# EasyEDA Pro project 【JHP硬件工作室】导出参考工程.epro

# Schematic Schematic1
Create Date: 2024-01-20; Page Name: P1; Project Name: New Project_2024-01-20_14-11-34; Schematic Name: Schematic1; Update Date: 2024-01-20; Company: 嘉立创EDA; Page Size: A4; Version: V1.0
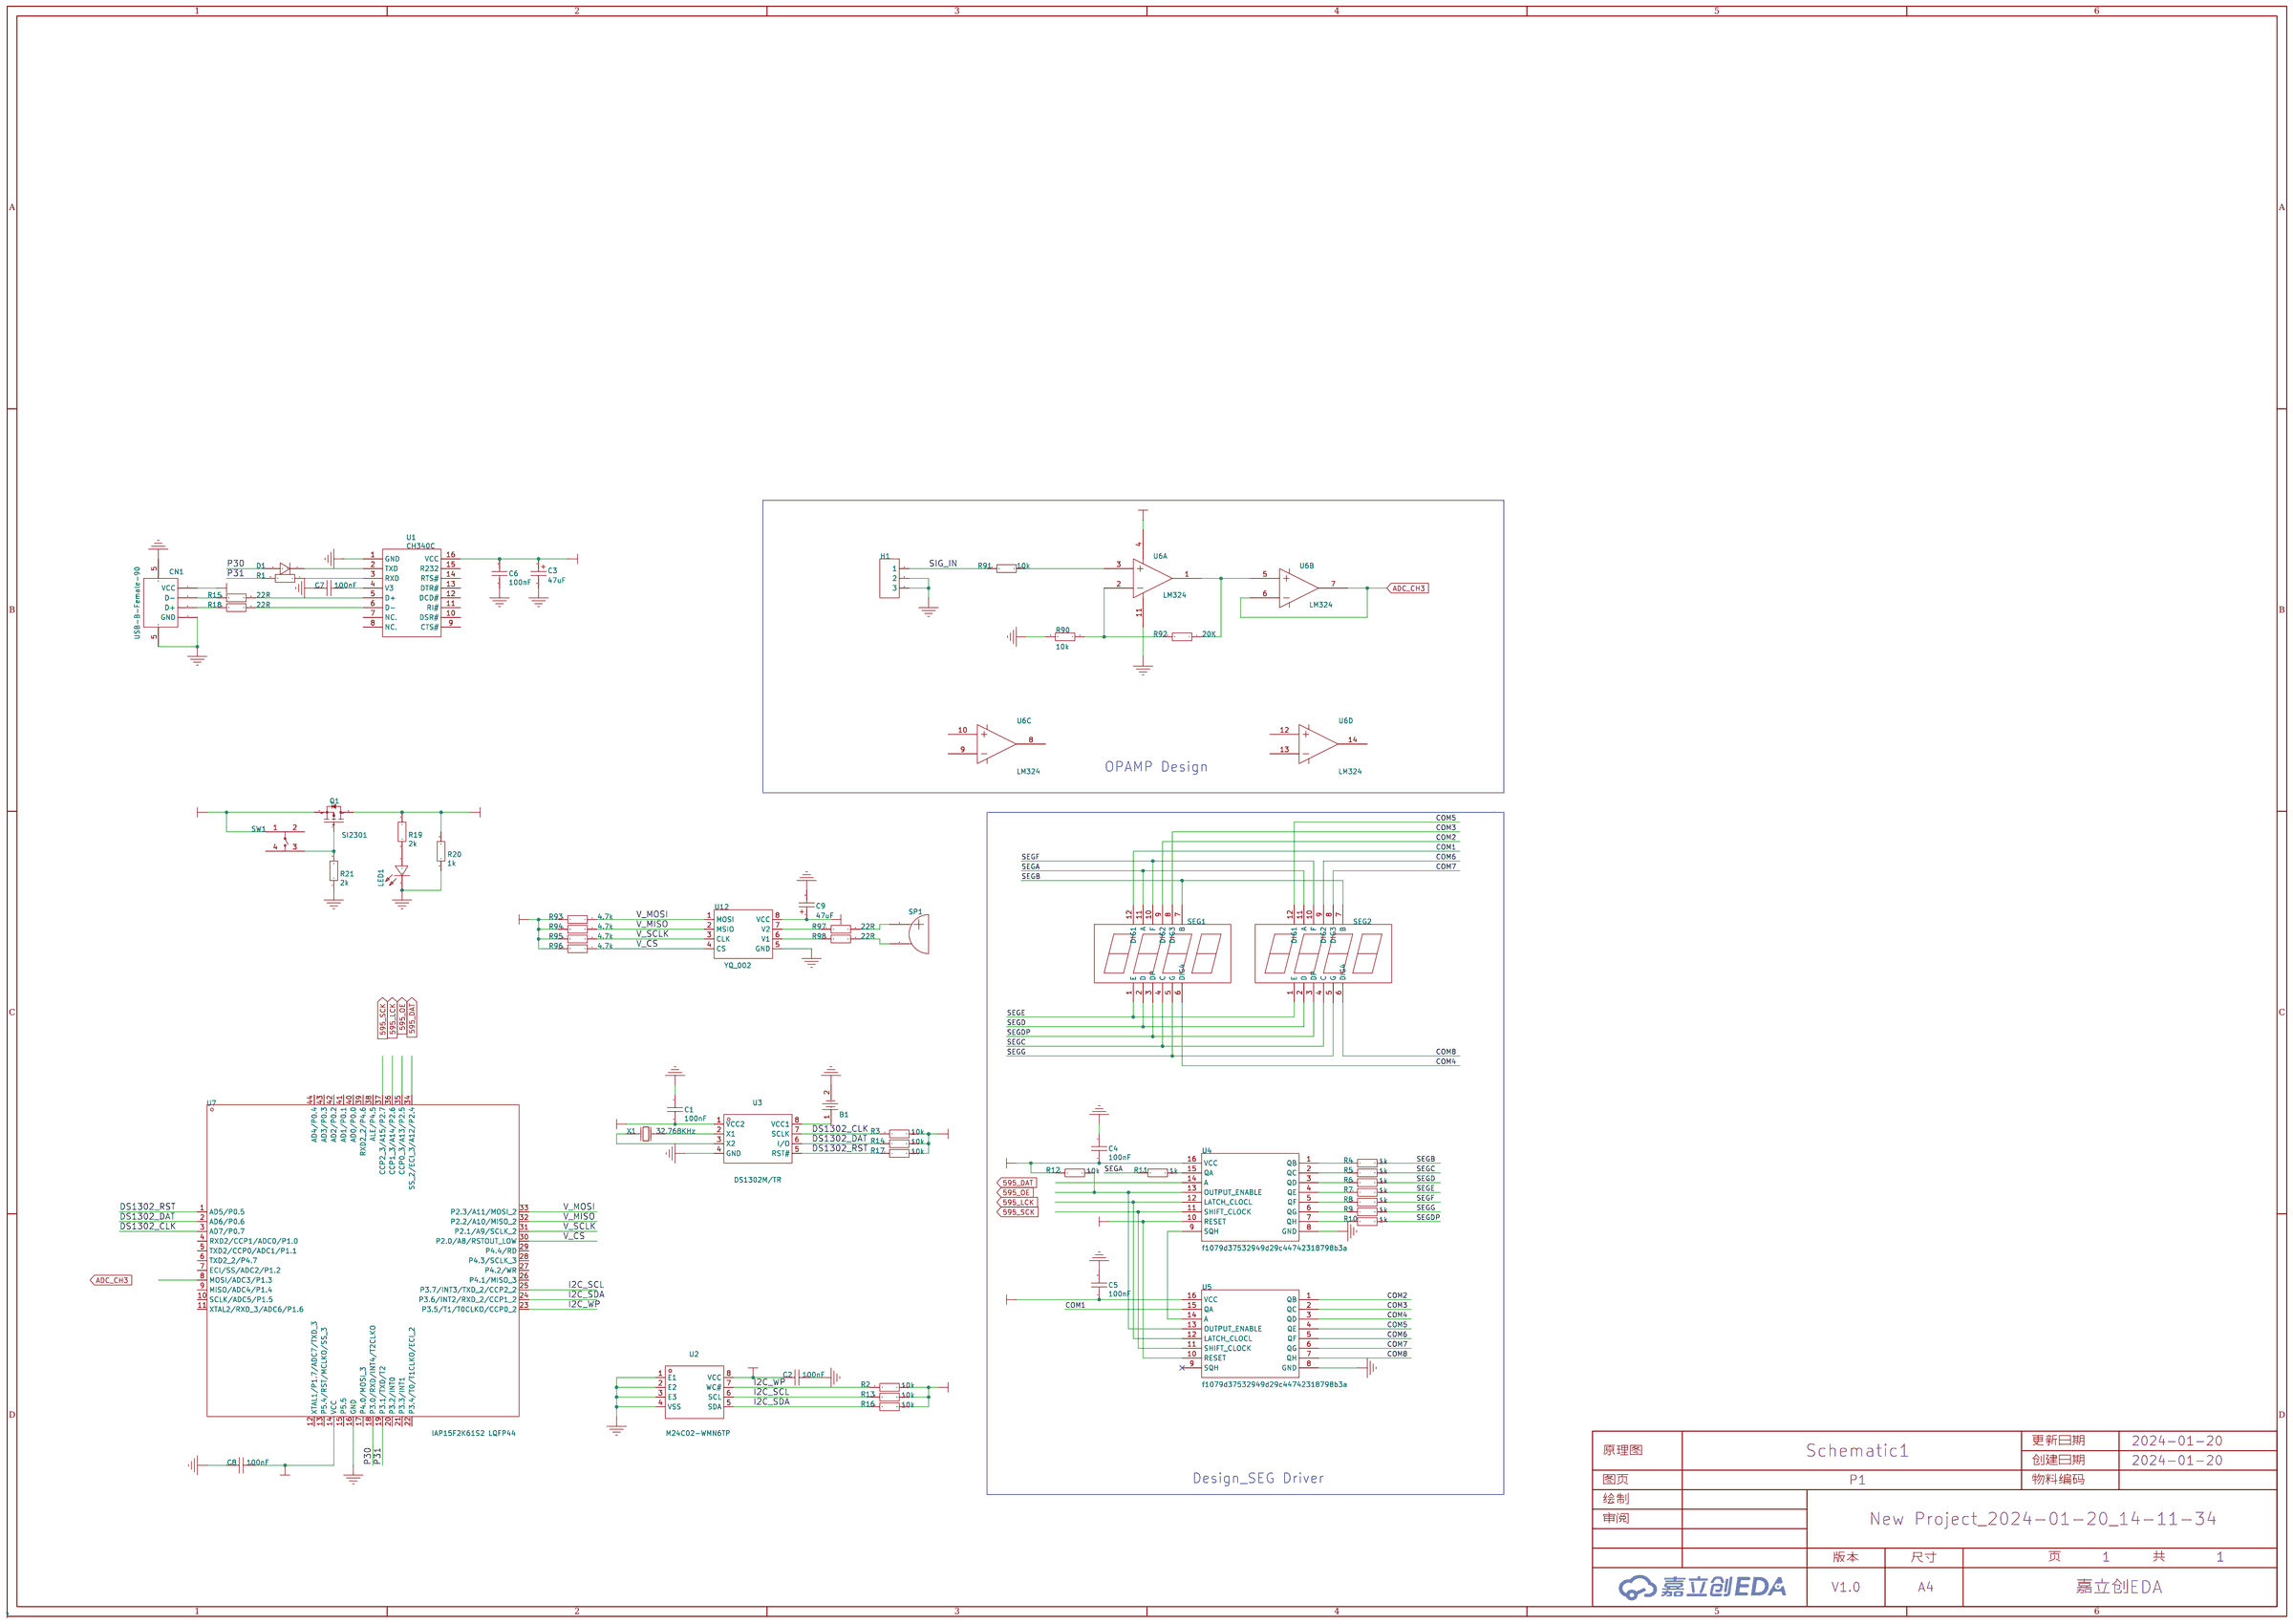
[diagram p0: schematic sheet]

## Parts
B1  CR1220-2  [BAT-CR1220]
C1  100nF  [C0805]
C2  100nF  [C0805]
C3  47uF  [CAP]
C4  100nF  [C0805]
C5  100nF  [C0805]
C6  100nF  [C0805]
C7  100nF  [C0805]
C8  100nF  [C0805]
C9  47uF  [CAP]
CN1  USB-B-Female-90  [USB-B]
D1  KLL4148  [DIODE]
H1  HDR-F-2.54_1x3  [HDR-F-2.54_1X3]
LED1  17-21URC/TR8  [LED0805]
Q1  SI2301  [SOT-23-3]
R1  1k  [R0805]
R2  10k  [R0805]
R3  10k  [R0805]
R4  1k  [R0805]
R5  1k  [R0805]
R6  1k  [R0805]
R7  1k  [R0805]
R8  1k  [R0805]
R9  1k  [R0805]
R10  1k  [R0805]
R11  1k  [R0805]
R12  10k  [R0805]
R13  10k  [R0805]
R14  10k  [R0805]
R15  22R  [R0805]
R16  10k  [R0805]
R17  10k  [R0805]
R18  22R  [R0805]
R19  2k  [R0805]
R20  1k  [R0805]
R21  2k  [R0805]
R90  10k  [R0805]
R91  10k  [R0805]
R92  20K  [R0805]
R93  4.7k  [R0805]
R94  4.7k  [R0805]
R95  4.7k  [R0805]
R96  4.7k  [R0805]
R97  22R  [R0805]
R98  22R  [R0805]
SEG1  5f80ded45edf411e9465a986f6a50c26  [LED-SEG]
SEG2  5f80ded45edf411e9465a986f6a50c26  [LED-SEG]
SP1  BUZZER  [BUZZ]
SW1  TS-1159UB-B-D-BL  [SW-SMD_4P]
U1  CH340C  [SOP-16]
U2  M24C02-WMN6TP  [SOP-8]
U3  DS1302M/TR  [SOP-8]
U4  f1079d37532949d29c44742318798b3a  [SOP-16]
U5  f1079d37532949d29c44742318798b3a  [SOP-16]
U6  LM324  [SO-14]  (sections 1,2,3,4)
U7  IAP15F2K61S2 LQFP44  [LQFP-44]
U12  YQ_002  [BW-SOP-8]
X1  32.768KHz  [XTAL-DT38]

## Library data of the parts
B1 = CR1220-2: Supplier: LCSC; Manufacturer: Q&J; image: //image.lceda.cn/szlcsc/C70381.jpg; Supplier Part: C70381
C1 C2 C4-C8 = 100nF: Supplier: LCSC; Manufacturer: FH; Manufacturer Part: 0805F104M500NT; Supplier Part: C28378
C3 C9 = 47uF: Polarized Capacitor (Axial); Design Item ID: Cap Pol2; Library Name: Miscellaneous Devices
CN1 = USB-B-Female-90: Supplier: LCSC; Manufacturer: ValuePro; Manufacturer Part: USB-BF90; image: //image.lceda.cn/szlcsc/C46392.jpg; Supplier Part: C46392
D1 = KLL4148: Supplier: LCSC; Supplier Part: C369941; Manufacturer: KEXIN
H1 = HDR-F-2.54_1x3: Supplier Part: C146690; Supplier: LCSC; Library Name: CT105
LED1 = 17-21URC/TR8: Supplier: LCSC; Supplier Part: C264414; Manufacturer: Everlight Elec
Q1 = SI2301: Supplier: LCSC; Manufacturer: Hottech; Supplier Part: C181086; JLCPCB Part Class: Extend
R1 R20 = 1k: Supplier: LCSC; Manufacturer: UniOhm; Manufacturer Part: 080500J0104T5E; Supplier Part: C149503
R2-R14 R16 R17 = 10k: Supplier: LCSC; Manufacturer: UniOhm; Manufacturer Part: 080500J0104T5E; Supplier Part: C149503
R15 R18 R97 R98 = 22R: Supplier: LCSC; Manufacturer: UniOhm; Manufacturer Part: 080500J0104T5E; Supplier Part: C149503; Design Item ID: 1k
R19 R21 = 2k: Supplier: LCSC; Manufacturer: UniOhm; Manufacturer Part: 080500J0104T5E; Supplier Part: C149503
R90 R91 = 10k: Supplier: LCSC; Manufacturer: UniOhm; Manufacturer Part: 080500J0104T5E; Supplier Part: C149503; Design Item ID: 1k
R92 = ?: Supplier: LCSC; Manufacturer: UniOhm; Manufacturer Part: 080500J0104T5E; Supplier Part: C149503; Design Item ID: 1k
R93-R96 = 4.7k: Supplier: LCSC; Manufacturer: UniOhm; Manufacturer Part: 080500J0104T5E; Supplier Part: C149503; Design Item ID: 1k
SEG1 SEG2 = SEG
SP1 = BUZZER: Buzzer; Library Name: *
SW1 = TS-1159UB-B-D-BL: Supplier: LCSC; Supplier Part: C692480; Manufacturer: XKB Connectivity
U1 = CH340C: Supplier: LCSC; Manufacturer: WCH; Supplier Part: C84681; JLCPCB Part Class: Extend
U2 = M24C02-WMN6TP: Supplier: LCSC; Manufacturer: STMicroelectronics; image: //image.lceda.cn/szlcsc/C7562.jpg; Supplier Part: C7562; JLCPCB Part Class: Basic
U3 = DS1302M/TR: Supplier: LCSC; Supplier Part: C434511; Manufacturer: HGSEMI
U4 U5 = 74HC595M/TR
U6 = LM324: Design Item ID: LM124; Library Name: *
U7 = IAP15F2K61S2 LQFP44: Supplier: LCSC; Manufacturer: STC; Supplier Part: C47451; JLCPCB Part Class: Extend
U12 = YQ_002: Design Item ID: LQ2021; Library Name: CT105
X1 = 32.768KHz: Supplier: LCSC; Supplier Part: C252404; Manufacturer: SHENZHEN CRYSTAL TECH; Manufacturer Part: 6K832768F12UB

## Nets
+5V: C1.1 C2.1 C4.1 C5.1 C8.2 C9.1 Q1.3(D) R2.2 R3.2 R12.1 R13.2 R14.2 R16.2 R17.2 R19.2 R20.2 R93.2 R94.2 R95.2 R96.2 U2.8(VCC) U3.1(VCC2) U4.10(RESET) U4.16(VCC) U5.10(RESET) U5.16(VCC) U6.4 U7.14(VCC) U12.8(VCC)
GND: B1.2 C1.2 C2.2 C3.2 C4.2 C5.2 C6.1 C7.1 C8.1 C9.2 CN1.4(GND) CN1.5(SH2) H1.2 H1.3 LED1.2(K) R20.1 R21.1 R90.2 U1.1(GND) U2.1(E1) U2.2(E2) U2.3(E3) U2.4(VSS) U3.4(GND) U4.8(GND) U5.8(GND) U6.11 U7.16(GND) U12.5(GND)
595_DAT: U4.14(A) U7.34(SS_2/ECI_3/A12/P2.4)
595_LCK: U4.12(LATCH_CLOCL) U5.12(LATCH_CLOCL) U7.36(CCP1_3/A14/P2.6)
595_OE: R12.2 U4.13(OUTPUT_ENABLE) U5.13(OUTPUT_ENABLE) U7.35(CCP0_3/A13/P2.5)
595_SCK: U4.11(SHIFT_CLOCK) U5.11(SHIFT_CLOCK) U7.37(CCP2_3/A15/P2.7)
ADC_CH3: U7.8(MOSI/ADC3/P1.3)
COM1: SEG1.12(DIG1) U5.15(QA)
COM2: SEG1.9(DIG2) U5.1(QB)
COM3: SEG1.8(DIG3) U5.2(QC)
COM4: SEG1.6(DIG4) U5.3(QD)
COM5: SEG2.12(DIG1) U5.4(QE)
COM6: SEG2.9(DIG2) U5.5(QF)
COM7: SEG2.8(DIG3) U5.6(QG)
COM8: SEG2.6(DIG4) U5.7(QH)
DS1302_CLK: R3.1 U3.7(SCLK) U7.3(AD7/P0.7)
DS1302_DAT: R14.1 U3.6(I/O) U7.2(AD6/P0.6)
DS1302_RST: R17.1 U3.5(RST#) U7.1(AD5/P0.5)
I2C_SCL: R13.1 U2.6(SCL) U7.25(P3.7/INT3/TXD_2/CCP2_2)
I2C_SDA: R16.1 U2.5(SDA) U7.24(P3.6/INT2/RXD_2/CCP1_2)
I2C_WP: R2.1 U2.7(WC#) U7.23(P3.5/T1/T0CLKO/CCP0_2)
P30: D1.2(A) U7.18(P3.0/RXD/INT4/T2CLKO)
P31: R1.2 U7.19(P3.1/TXD/T2)
SEGA: R11.1 SEG1.11(A) SEG2.11(A)
SEGB: R4.2 SEG1.7(B) SEG2.7(B)
SEGC: R5.2 SEG1.4(C) SEG2.4(C)
SEGD: R6.2 SEG1.2(D) SEG2.2(D)
SEGDP: R10.2 SEG1.3(DP) SEG2.3(DP)
SEGE: R7.2 SEG1.1(E) SEG2.1(E)
SEGF: R8.2 SEG1.10(F) SEG2.10(F)
SEGG: R9.2 SEG1.5(G) SEG2.5(G)
SIG_IN: H1.1 R91.2
V_CS: R96.1 U7.30(P2.0/A8/RSTOUT_LOW) U12.4(CS)
V_MISO: R94.1 U7.32(P2.2/A10/MISO_2) U12.2(MSIO)
V_MOSI: R93.1 U7.33(P2.3/A11/MOSI_2) U12.1(MOSI)
V_SCLK: R95.1 U7.31(P2.1/A9/SCLK_2) U12.3(CLK)
VUSB: C3.1 C6.2 CN1.1(VCC) Q1.2(S) SW1.1 U1.16(VCC)
$1N1823: U3.2(X1) X1.2(OSC2)
$1N1825: U3.3(X2) X1.1(OSC1)
$1N1898: B1.1 U3.8(VCC1)
$1N1910: R1.1 U1.3(RXD)
$1N1912: D1.1(C) U1.2(TXD)
$1N1918: C7.2 U1.4(V3)
$1N1920: CN1.2(D-) R15.2
$1N1922: CN1.3(D+) R18.2
$1N1964: Q1.1(G) R21.2 SW1.3
$1N1967: U6.6 U6.7
$1N1974: R91.1 U6.3
$1N1985: R92.1 U6.1 U6.5
$1N1990: R90.1 R92.2 U6.2
$1N1998: R98.1 U12.6(V1)
$1N2000: R97.1 U12.7(V2)
$1N2030: R97.2 SP1.1
$1N2034: R98.2 SP1.2
$1N2066: LED1.1(A) R19.1
$1N4705: R11.2 U4.15(QA)
$1N4961: R4.1 U4.1(QB)
$1N4962: R5.1 U4.2(QC)
$1N4964: R6.1 U4.3(QD)
$1N4966: R7.1 U4.4(QE)
$1N4968: R8.1 U4.5(QF)
$1N4970: R9.1 U4.6(QG)
$1N4972: R10.1 U4.7(QH)
$1N5017: U4.9(SQH) U5.14(A)
$1N6015: R15.1 U1.5(D+)
$1N6017: R18.1 U1.6(D-)

Not connected (* = marked no-connect by the designer): SW1 2 4; U1 7(NC.) 8(NC.) 9(CTS#) 10(DSR#) 11(RI#) 12(DCD#) 13(DTR#) 14(RTS#) 15(R232); U5 9(SQH)*; U6 8 9 10 12 13 14; U7 4(RXD2/CCP1/ADC0/P1.0) 5(TXD2/CCP0/ADC1/P1.1) 6(TXD2_2/P4.7) 7(ECI/SS/ADC2/P1.2) 9(MISO/ADC4/P1.4) 10(SCLK/ADC5/P1.5) 11(XTAL2/RXD_3/ADC6/P1.6) 12(XTAL1/P1.7/ADC7/TXD_3) 13(P5.4/RST/MCLKO/SS_3) 15(P5.5) 17(P4.0/MOSI_3) 20(P3.2/INT0) 21(P3.3/INT1) 22(P3.4/T0/T1CLKO/ECI_2) 26(P4.1/MISO_3) 27(P4.2/WR) 28(P4.3/SCLK_3) 29(P4.4/RD) 38(ALE/P4.5) 39(RXD2_2/P4.6) 40(AD0/P0.0) 41(AD1/P0.1) 42(AD2/P0.2) 43(AD3/P0.3) 44(AD4/P0.4)

## Notes on the sheet
- OPAMP Design
- Design_SEG Driver

# Board PCB1
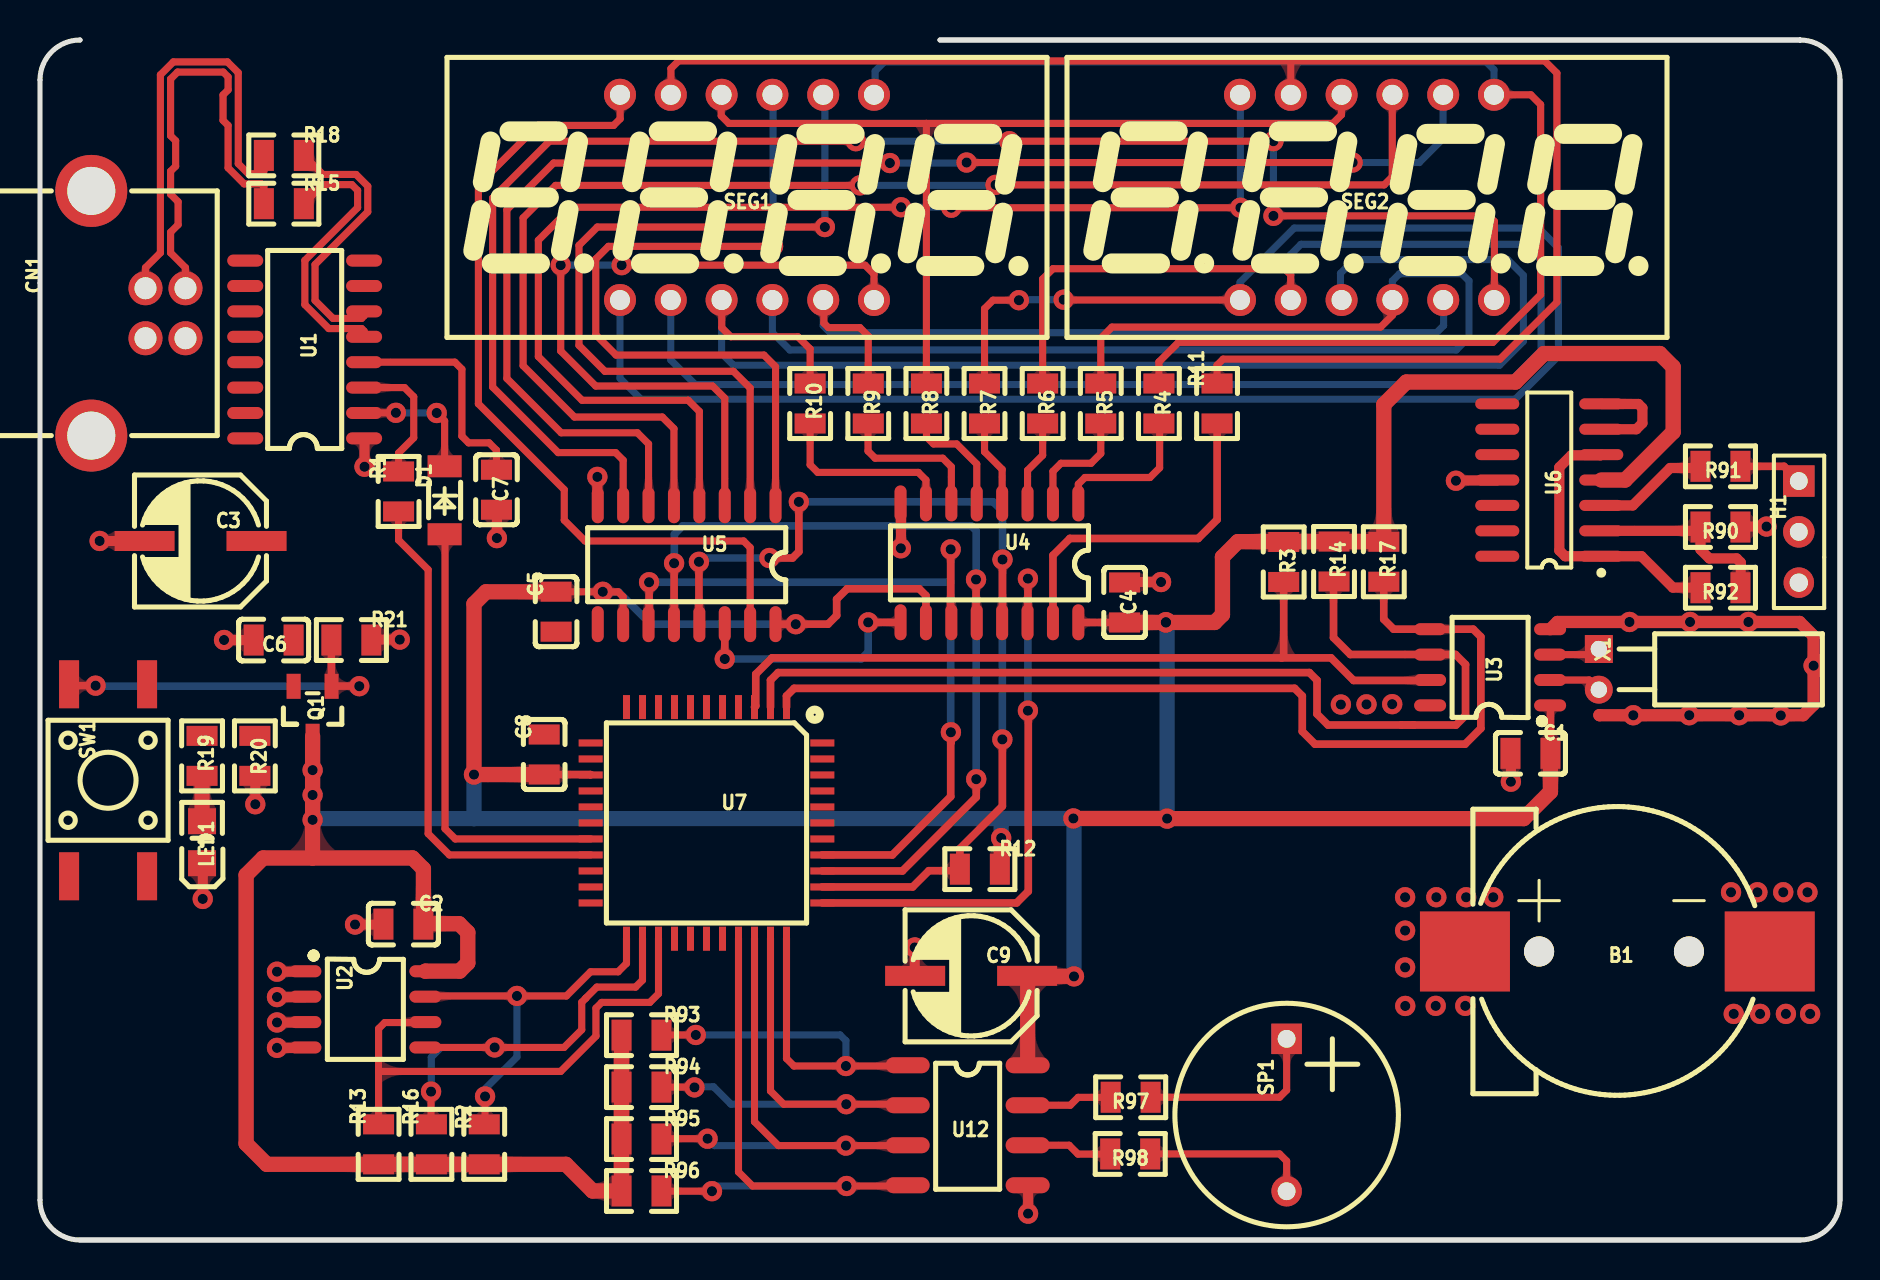
[diagram p1: board, top side]
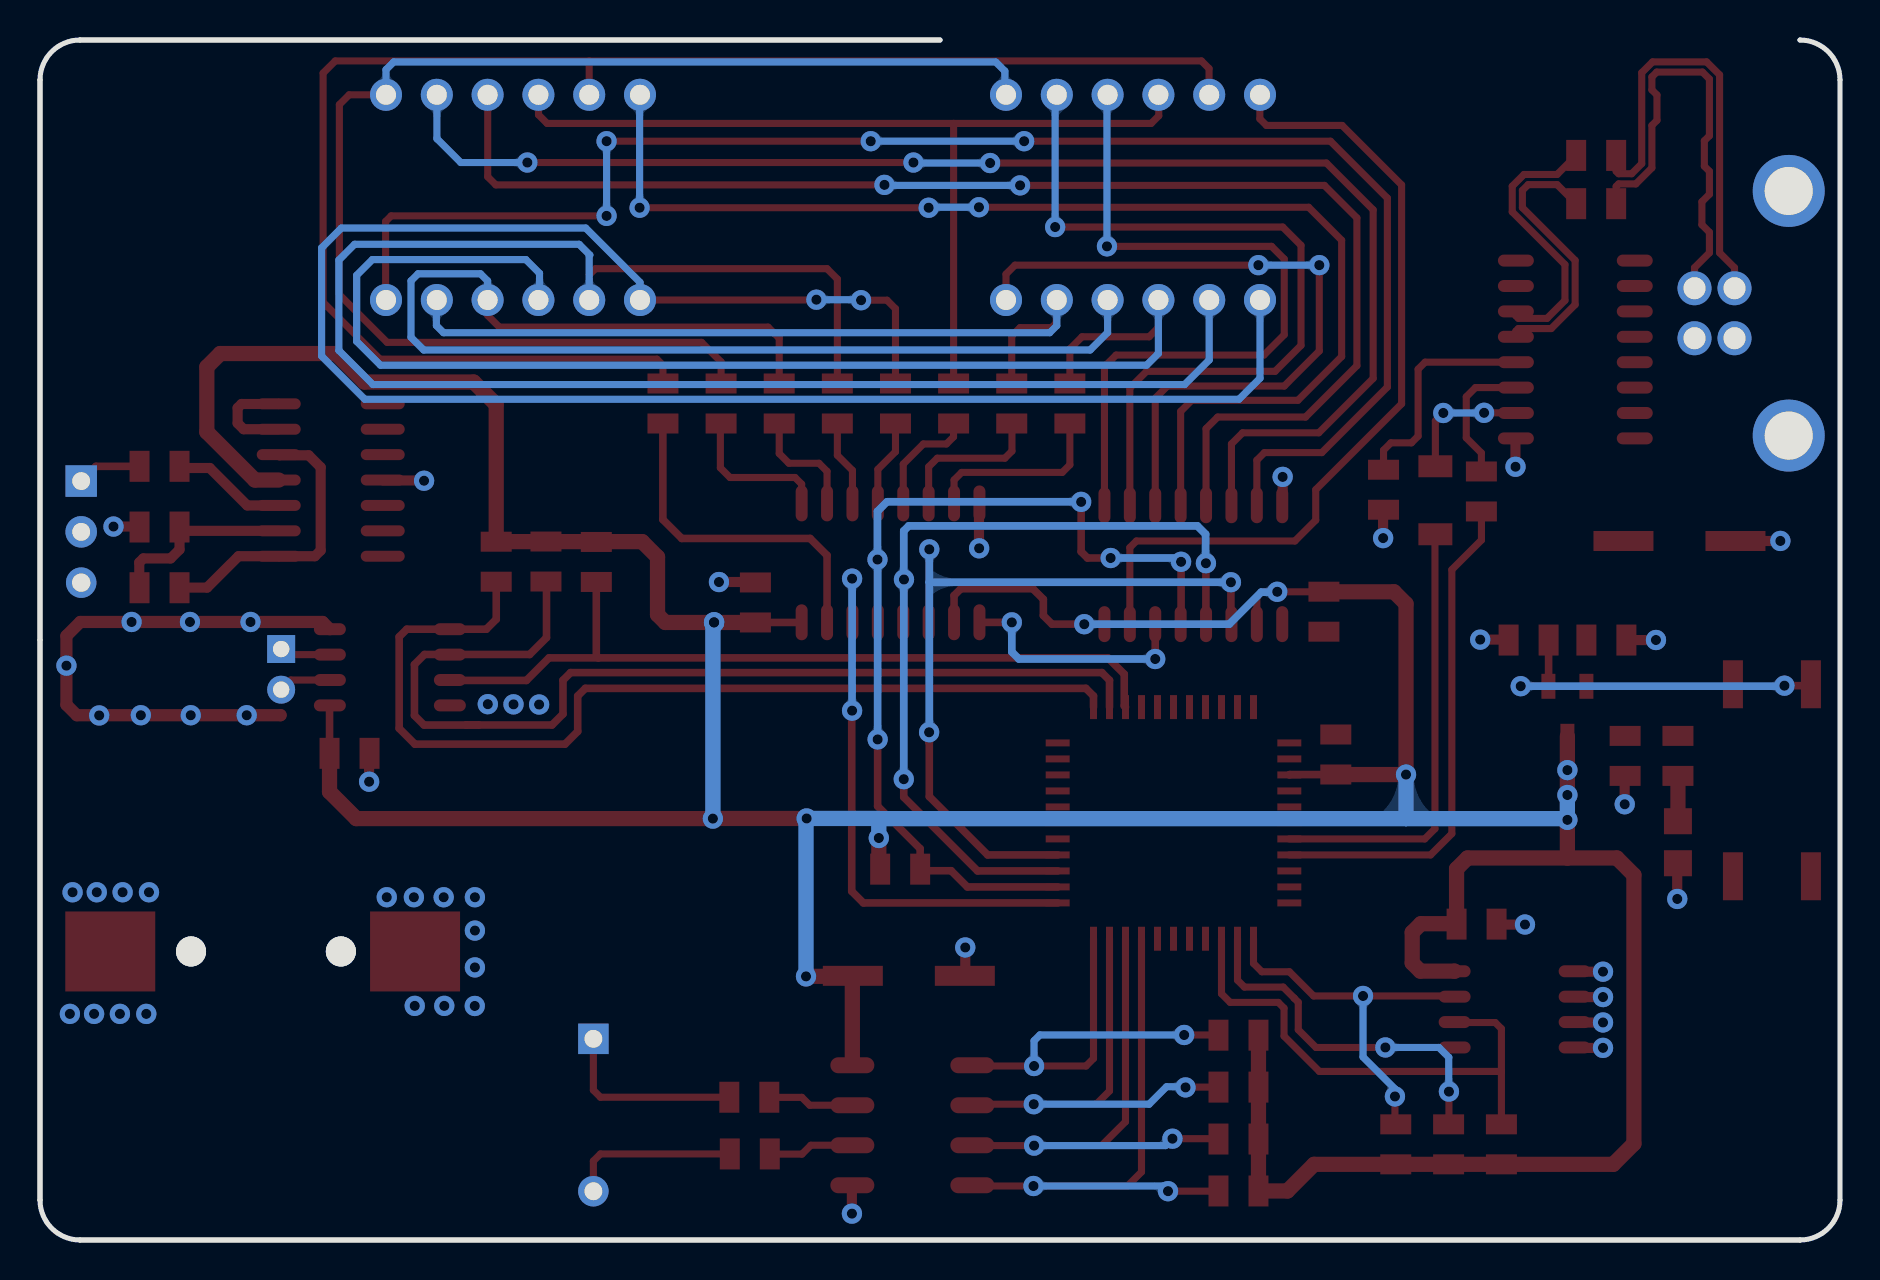
[diagram p2: board, bottom side, seen from below]

Outline 90 x 60 mm; copper layers: Top Layer, Bottom Layer. Coordinates in mm from the lower left corner of the outline.
Outline path: 2,60 arc(0.59,59.41) 0,58 0,2 arc(0.59,0.59) 2,0 ; 2,0 88,0 ; 2,0 88,0 ; 88,0 arc(89.41,0.59) 90,2 ; 88,60 45,60 88,60 ; 88,60 arc(89.41,59.41) 90,58 ; 90,58 90,2 ; 90,58 90,2
Stack: Top Layer 0.035mm / Dielectric1 1.51mm FR4 er 4.5 / Bottom Layer 0.035mm

## Design rules (mm)
net +5V: pwr
net GND: pwr
net VUSB: pwr
net $1N1922: DP1
net $1N1920: DP1
net $1N6015: DP2
net $1N6017: DP2
template: 自定义配置
spacing copperThickness1oz (default): track to track 0.356, other pairs 0.203 to 0.762
spacing copperThickness2oz: track to track 0.203, other pairs 0.152 to 0.3
track width copperThickness1oz (default): min 0.356, default 0.381, max 2.54
track width copperThickness2oz: min 0.203, default 0.254, max 2.54
track width pwr: min 0.356, default 0.762, max 2.54
differential pair differentialPair (default): width min 0.127, default 0.254, max 2.54; gap min 0.152, default 0.152
via viaSize (default): diameter min 1.016, default 1.016, max 1.016; hole min 0.508, default 0.508, max 0.508
net class pwr uses pwr
net +5V uses pwr
net GND uses pwr
net VUSB uses pwr

## Placement (name value [footprint] x y rotation side)
B1  CR1220-2  [BAT-CR1220]  78.87 14.43 0 top
C1  100nF  [C0805]  74.52 24.33 180 top
C2  100nF  [C0805]  18.17 15.79 180 top
C3  47uF  [CAP]  8.03 34.95 180 top
C4  100nF  [C0805]  54.23 31.88 90 top
C5  100nF  [C0805]  25.8 31.42 270 top
C6  100nF  [C0805]  11.68 30 0 top
C7  100nF  [C0805]  22.82 37.51 90 top
C8  100nF  [C0805]  25.21 24.28 270 top
C9  47uF  [CAP]  46.56 13.21 180 top
CN1  USB-B-Female-90  [USB-B]  7.27 45.09 270 top
D1  KLL4148  [DIODE]  20.23 36.99 270 top
H1  HDR-F-2.54_1x3  [HDR-F-2.54_1X3]  87.94 35.41 270 top
LED1  17-21URC/TR8  [LED0805]  8.1 19.89 90 top
Q1  SI2301  [SOT-23-3]  13.63 26.44 90 top
R1  1k  [R0805]  17.93 37.43 270 top
R2  10k  [R0805]  22.21 4.78 270 top
R3  10k  [R0805]  62.18 33.9 90 top
R4  1k  [R0805]  55.95 41.82 90 top
R5  1k  [R0805]  53.04 41.82 90 top
R6  1k  [R0805]  50.13 41.82 90 top
R7  1k  [R0805]  47.23 41.82 90 top
R8  1k  [R0805]  44.32 41.82 90 top
R9  1k  [R0805]  41.41 41.82 90 top
R10  1k  [R0805]  38.51 41.82 90 top
R11  1k  [R0805]  58.85 41.82 270 top
R12  10k  [R0805]  46.99 18.54 180 top
R13  10k  [R0805]  16.93 4.78 270 top
R14  10k  [R0805]  64.7 33.92 90 top
R15  22R  [R0805]  12.19 51.82 180 top
R16  10k  [R0805]  19.57 4.78 270 top
R17  10k  [R0805]  67.19 33.91 90 top
R18  22R  [R0805]  12.19 54.23 180 top
R19  2k  [R0805]  8.1 24.21 90 top
R20  1k  [R0805]  10.74 24.21 90 top
R21  2k  [R0805]  15.57 30 180 top
R90  10k  [R0805]  84.02 35.65 0 top
R91  10k  [R0805]  84.02 38.68 0 top
R92  20K  [R0805]  84.02 32.61 0 top
R93  4.7k  [R0805]  30.08 10.24 180 top
R94  4.7k  [R0805]  30.08 7.64 180 top
R95  4.7k  [R0805]  30.08 5.05 180 top
R96  4.7k  [R0805]  30.08 2.45 180 top
R97  22R  [R0805]  54.53 7.14 0 top
R98  22R  [R0805]  54.51 4.3 0 top
SEG1  5f80ded45edf411e9465a986f6a50c26  [LED-SEG]  29 47 0 top
SEG2  5f80ded45edf411e9465a986f6a50c26  [LED-SEG]  60 47 0 top
SP1  BUZZER  [BUZZ]  62.33 10.06 270 top
SW1  TS-1159UB-B-D-BL  [SW-SMD_4P]  3.4 22.99 270 top
U1  CH340C  [SOP-16]  13.23 44.53 90 top
U2  M24C02-WMN6TP  [SOP-8]  16.27 11.53 270 top
U3  DS1302M/TR  [SOP-8]  72.51 28.63 90 top
U4  f1079d37532949d29c44742318798b3a  [SOP-16]  47.47 33.86 180 top
U5  f1079d37532949d29c44742318798b3a  [SOP-16]  32.33 33.77 180 top
U6  LM324  [SO-14]  75.46 38 90 top
U7  IAP15F2K61S2 LQFP44  [LQFP-44]  33.32 20.85 180 top
U12  YQ_002  [BW-SOP-8]  43.38 8.74 0 top
X1  32.768KHz  [XTAL-DT38]  77.94 29.55 90 top

## Footprints (pads in the part's own frame, mm; a bottom-side part is the same pattern mirrored in y, then rotated)
BAT-CR1220
  rect 4.5x4 smd: 1(-7.62,0) 2(7.62,0)
  round 1.5 hole 1.5: 3(3.582,0) 4(-3.912,0)
BUZZ
  rect 1.524x1.524 hole 0.889: 1(0,0)
  round 1.524 hole 0.889: 2(7.62,0)
BW-SOP-8
  oval 2.2x0.8 smd: 1(0,0) 2(0,-2) 3(0,-4) 4(0,-6) 5(6,-6) 6(6,-4) 7(6,-2) 8(6,0)
C0805
  rect 1x1.55 smd: 1(-1,0) 2(1,0)
CAP
  rect 3x1 smd: 1(-2.8,0) 2(2.8,0)
DIODE
  rect 1.1x1.7 smd: 1(-1.7,0) 2(1.7,0)
HDR-F-2.54_1X3
  rect 1.575x1.575 hole 0.889: 1(-2.54,0)
  round 1.575 hole 0.889: 2(0,0)
  round 1.524 hole 0.914: 3(2.54,0)
LED0805
  rect 1.3x1.399 smd: 1(1.05,0) 2(-1.05,0)
LED-SEG
  round 1.6 hole 1: 1(0,0) 2(2.54,0) 3(5.08,0) 4(7.62,0) 5(10.16,0) 6(12.7,0) 7(12.7,10.26) 8(10.16,10.26) 9(7.62,10.26) 10(5.08,10.26) 11(2.54,10.26) 12(0,10.26)
LQFP-44
  rect 0.35x1.2 smd: 1(-4,-5.791) 2(-3.2,-5.791) 3(-2.4,-5.791) 4(-1.6,-5.791) 5(-0.8,-5.791) 6(0,-5.791) 7(0.8,-5.791) 8(1.6,-5.791) 9(2.4,-5.791) 10(3.2,-5.791) 11(4,-5.791) 23(4,5.791) 24(3.2,5.791) 25(2.4,5.791) 26(1.6,5.791) 27(0.8,5.791) 28(0,5.791) 29(-0.8,5.791) 30(-1.6,5.791) 31(-2.4,5.791) 32(-3.2,5.791) 33(-4,5.791)
  rect 1.2x0.35 smd: 12(5.791,-4) 13(5.791,-3.2) 14(5.791,-2.4) 15(5.791,-1.6) 16(5.791,-0.8) 17(5.791,0) 18(5.791,0.8) 19(5.791,1.6) 20(5.791,2.4) 21(5.791,3.2) 22(5.791,4) 34(-5.791,4) 35(-5.791,3.2) 36(-5.791,2.4) 37(-5.791,1.6) 38(-5.791,0.8) 39(-5.791,0) 40(-5.791,-0.8) 41(-5.791,-1.6) 42(-5.791,-2.4) 43(-5.791,-3.2) 44(-5.791,-4)
R0805
  rect 1x1.55 smd: 1(-1,0) 2(1,0)
SO-14
  oval 0.55x2.2 smd: 1(-3.81,-2.6) 2(-2.54,-2.6) 3(-1.27,-2.6) 4(0,-2.6) 5(1.27,-2.6) 6(2.54,-2.6) 7(3.81,-2.6) 8(3.81,2.6) 9(2.54,2.6) 10(1.27,2.6) 11(0,2.6) 12(-1.27,2.6) 13(-2.54,2.6) 14(-3.81,2.6)
SOP-8
  oval 0.6x1.598 smd: 1(-1.905,-3) 2(-0.635,-3) 3(0.635,-3) 4(1.905,-3) 5(1.905,3) 6(0.635,3) 7(-0.635,3) 8(-1.905,3)
SOP-16
  oval 0.6x1.798 smd: 1(-4.445,-2.972) 2(-3.175,-2.972) 3(-1.905,-2.972) 4(-0.635,-2.972) 5(0.635,-2.972) 6(1.905,-2.972) 7(3.175,-2.972) 8(4.445,-2.972) 9(4.445,2.972) 10(3.175,2.972) 11(1.905,2.972) 12(0.635,2.972) 13(-0.635,2.972) 14(-1.905,2.972) 15(-3.175,2.972) 16(-4.445,2.972)
SOT-23-3
  rect 1.25x0.7 smd: 1(1.25,-0.95) 2(1.25,0.95) 3(-1.25,0)
SW-SMD_4P
  rect 2.4x1 smd: 1(-4.8,1.95) 2(4.8,1.95) 3(-4.8,-1.95) 4(4.8,-1.95)
USB-B
  round 1.7 hole 1.1: 1(0,0) 2(-2.5,0) 3(-2.5,-2) 4(0,-2)
  round 3.6 hole 2.4: 5(-7.367,-4.71) 5(4.867,-4.71)
XTAL-DT38
  rect 1.397x1.397 hole 0.813: 1(0,0)
  round 1.397 hole 0.813: 2(-2.032,0)

## Nets
As in the schematic.

Pads without a net: B1 3 4; SW1 2 4; U1 7 8 9 10 11 12 13 14 15; U5 9; U6 8 9 10 12 13 14; U7 4 5 6 7 9 10 11 12 13 15 17 20 21 22 26 27 28 29 38 39 40 41 42 43 44

## Via types
v1: diameter 1.016, hole 0.508, Top Layer to Bottom Layer, 109 vias

## Routing (per net, layer and track width the routed paths; a pad name or vN(x,y) marks a point on that pad's centre or on a via; arc(x,y) is an arc through that point)
+5V: length 256
  Top Layer w0.355: 25.8,32.41 v1(28.14,32.41) 28.91,32.41 29.16,32.16 29.16,30.79
  Top Layer w0.381: C1.1 75.52,26.71 75.51,26.73 ; U4.10 44.3,32.22 43.96,32.56 40.36,32.56 39.83,32.04 39.83,31.22 39.4,30.79 37.79,30.79 v1(37.79,30.79) 37.78,30.79 U5.16 ; C4.1 51.93,30.88 U4.16 ; U7.14 27.52,23.27 25.21,23.27
  Top Layer w0.762: U2.8 19.28,13.44 20.98,13.44 21.39,13.85 21.39,15.38 20.95,15.81 19.19,15.81 C2.1 19.17,18.56 18.63,19.1 13.63,19.1 ; 56.29,30.88 v1(56.3,30.89) v1(56.3,30.88) ; 56.29,30.88 v1(56.3,30.88) ; 56.29,30.88 C4.1 ; 13.63,19.1 11.16,19.1 10.31,18.25 10.31,4.82 11.34,3.78 R13.2 R16.2 R2.2 26.3,3.78 27.63,2.45 R96.2 R95.2 R94.2 R93.2 ; 13.63,19.1 v1(13.63,21.01) v1(13.63,22.25) v1(13.63,23.49) Q1.3 ; v1(48.06,20.1) 48.06,18.61 R12.1 ; 49.38,13.18 U12.8 ; 49.38,13.18 C9.1 ; 49.38,13.18 51.7,13.18 v1(51.7,13.18) ; U6.4 79.26,38 81.66,40.4 81.66,43.65 80.99,44.32 75.2,44.32 73.78,42.9 68.32,42.9 67.19,41.77 R17.2 67.19,34.92 64.69,34.92 ; 62.17,34.92 64.69,34.92 ; 62.17,34.92 59.89,34.92 59.12,34.15 59.12,31.27 58.73,30.88 v1(56.3,30.88) ; 62.17,34.92 R3.2 ; 64.69,34.92 R14.2 ; C5.1 25.8,32.41 22.3,32.41 21.7,31.81 v1(21.7,23.27) 25.21,23.27 C8.2 ; v1(51.67,21.08) 56.35,21.08 v1(56.36,21.07) 74.18,21.07 75.52,22.41 C1.1
  Bottom Layer w0.381: v1(28.14,32.41) 28.16,32.39 28.94,32.39 30.54,30.79 v1(37.79,30.79)
  Bottom Layer w0.762: 21.7,21.07 13.63,21.07 v1(13.63,22.25) ; 21.7,21.07 v1(21.7,23.27) ; 21.7,21.07 48.06,21.07 ; v1(51.7,13.18) 51.7,21.05 v1(51.67,21.08) 48.07,21.08 48.06,21.07 ; 48.06,21.07 v1(48.06,20.1) ; v1(56.36,21.07) 56.36,30.82 v1(56.3,30.88)
GND: length 58.8
  Top Layer w0.508: v1(11.85,13.42) 11.85,13.41 13.25,13.41 ; 72.84,37.98 70.81,37.98 v1(70.8,37.96) ; v1(2.98,34.95) 2.98,34.95 C3.2 ; v1(11.85,9.61) 11.85,9.6 13.25,9.6 ; 56.05,32.9 54.25,32.9 ; 16.23,40.06 16.23,38.67 v1(16.23,38.66) ; 49.41,2.71 49.41,1.32 v1(49.4,1.32) ; v1(10.76,21.79) 10.77,21.79 10.77,23.18 ; v1(43.04,34.58) 43.05,34.59 43.05,36.81 ; 27.86,36.76 27.86,38.15 v1(27.87,38.16) ; v1(86.33,35.67) 86.32,35.67 84.93,35.67 ; C6.1 9.2,30 v1(9.2,30) ; 13.25,10.87 11.85,10.87 v1(11.85,10.88) ; 17.15,15.77 15.75,15.77 v1(15.75,15.77) ; v1(8.14,17.05) 8.14,17.06 8.14,18.45 ; 22.85,36.49 22.85,35.1 v1(22.84,35.09) ; 73.55,24.31 73.55,22.92 v1(73.54,22.91) ; R21.1 16.59,30.02 17.99,30.02 v1(17.99,30.02) ; 43.74,13.23 43.74,14.62 v1(43.74,14.63) ; 13.25,12.14 11.85,12.14 v1(11.85,12.15)
  Top Layer w0.61: U3.4 75.87,30.9 v1(79.47,30.9) v1(82.5,30.9) v1(85.42,30.9) 87.98,30.9 88.68,30.21 v1(88.68,28.72) 88.68,26.76 88.16,26.24 v1(84.96,26.24) v1(82.46,26.24) v1(79.66,26.24) 77.98,26.24 77.97,26.25
  vias: v1(56.05,32.9) v1(84.55,17.39) v1(84.69,11.31) v1(85.87,17.39) v1(86,11.31) v1(87.04,26.23) v1(87.16,17.39) v1(87.3,11.31) v1(88.37,17.39) v1(88.51,11.31)
595_DAT: length 28.4
  Top Layer w0.381: U7.34 48.83,16.85 49.41,17.44 49.41,26.45 v1(49.4,26.47) ; U4.14 49.4,30.9 v1(49.4,33.07)
  Bottom Layer w0.381: v1(49.4,26.47) v1(49.4,33.07)
595_LCK: length 44.6
  Top Layer w0.381: v1(31.7,33.84) 31.7,30.8 U5.12 ; U7.36 43.12,18.45 46.81,22.14 v1(46.81,23.04) ; v1(46.8,33.03) 46.8,30.92 U4.12
  Bottom Layer w0.381: 46.81,33.02 v1(46.8,33.03) ; 46.81,33.02 46.81,35.46 46.56,35.7 32.13,35.7 31.72,35.29 31.72,33.85 v1(31.7,33.84) ; 46.81,33.02 v1(46.81,23.04)
595_OE: length 50.4
  Top Layer w0.381: v1(37.94,36.91) 37.94,34.42 37.62,34.1 v1(36.47,34.1) ; U5.13 32.95,30.81 v1(32.95,33.91) ; v1(48.13,34.02) 48.13,30.9 U4.13 ; U7.35 43.63,17.65 44.44,18.46 45.91,18.46 R12.2 45.99,19.57 48.12,21.69 v1(48.12,25.03)
  Bottom Layer w0.381: v1(36.47,34.1) 33.14,34.1 v1(32.95,33.91) ; v1(48.12,25.03) 48.12,34.02 v1(48.13,34.02) 48.13,36.43 47.65,36.91 37.95,36.91 v1(37.94,36.91)
595_SCK: length 40.8
  Top Layer w0.381: v1(45.54,25.39) 45.54,24.87 45.53,24.86 45.53,22.17 42.62,19.25 U7.37 ; v1(45.53,34.53) 45.53,30.92 U4.11 ; U5.11 30.45,30.82 v1(30.45,32.89)
  Bottom Layer w0.381: 45.53,32.89 45.53,32.89 v1(30.45,32.89) ; 45.53,32.89 v1(45.53,34.53) ; 45.53,32.89 45.53,25.4 v1(45.54,25.39)
COM1: length 41.9
  Top Layer w0.355: SEG1.12 29.01,57.25 29.01,56.06 28.68,55.73 24.89,55.73 21.92,52.76 21.92,41.81 26.21,37.52 26.21,35.99 27.25,34.95 35.18,34.95 35.51,34.62 U5.15
COM2: length 37.1
  Top Layer w0.355: v1(36.65,49.68) 28.42,49.68 27.79,49.05 27.79,45.26 28.8,44.25 36.19,44.25 36.78,43.66 U5.1
  Bottom Layer w0.355: v1(36.65,49.68) 36.65,57.23 SEG1.9
COM3: length 39.6
  Top Layer w0.355: v1(39.24,50.65) 27.86,50.65 26.95,49.73 26.95,44.73 28.25,43.43 34.67,43.43 35.51,42.6 U5.2
  Bottom Layer w0.355: SEG1.8 39.24,57.18 v1(39.24,50.65)
COM4: length 36
  Top Layer w0.355: v1(26.03,48.74) 26.03,44.45 27.79,42.7 33.63,42.7 34.24,42.09 U5.3 ; v1(29.08,48.74) 41.25,48.74 41.7,48.29 SEG1.6
  Bottom Layer w0.355: v1(26.03,48.74) v1(29.08,48.74)
COM5: length 61.1
  Top Layer w0.355: U5.4 32.97,41.43 32.41,41.99 27.1,41.99 24.92,44.17 24.92,49.99 26.57,51.64 43.05,51.64 ; v1(60.02,51.61) v1(45.57,51.61)
  Bottom Layer w0.355: v1(45.57,51.61) 45.54,51.64 v1(43.05,51.64) ; v1(60.02,51.61) 60.02,57.24 SEG2.12
COM6: length 68.5
  Top Layer w0.355: v1(47.78,52.76) 67.21,52.76 67.62,53.16 67.62,57.25 SEG2.9 ; U5.5 31.7,40.56 31.12,41.15 26.72,41.15 24.16,43.71 24.16,51.11 25.78,52.73 v1(41,52.73)
  Bottom Layer w0.355: v1(41,52.73) 47.75,52.73 v1(47.78,52.76)
COM7: length 70.4
  Top Layer w0.355: U5.6 30.43,39.8 29.87,40.36 26.06,40.36 23.34,43.08 23.34,51.51 25.68,53.85 v1(42.49,53.85) ; v1(65.63,53.87) v1(46.33,53.87)
  Bottom Layer w0.355: v1(65.63,53.87) 68.96,53.87 70.16,55.07 70.16,57.25 SEG2.8 ; v1(46.33,53.87) 46.3,53.85 v1(42.49,53.85)
COM8: length 78.8
  Top Layer w0.355: v1(48.46,54.94) v1(61.67,54.94) ; v1(61.67,51.21) 72.44,51.21 72.72,50.93 72.72,47.02 SEG2.6 ; U5.7 29.16,38.99 28.78,39.37 25.91,39.37 22.63,42.65 22.63,52.1 25.48,54.94 v1(40.79,54.94)
  Bottom Layer w0.355: v1(61.67,54.94) v1(61.67,51.21) ; v1(40.79,54.94) v1(48.46,54.94)
DS1302_CLK: length 40
  Top Layer w0.381: U3.7 69.49,27.98 65.68,27.98 64.55,29.11 62.08,29.11 ; 62.08,29.11 62.18,29.21 R3.1 ; 62.08,29.11 36.6,29.11 35.79,28.29 35.79,26.71 U7.3
DS1302_DAT: length 51.7
  Top Layer w0.381: 68.06,25.75 68.69,25.75 ; 68.06,25.75 68.69,25.75 68.69,25.75 ; 68.06,25.75 64.4,25.75 63.85,26.3 63.85,27.99 63.47,28.37 36.91,28.37 36.53,27.99 U7.2 ; 68.69,25.75 70.8,25.75 71.28,26.23 71.28,28.77 70.77,29.28 69.51,29.28 ; 69.51,29.28 65.52,29.28 64.68,30.12 64.68,32.9 R14.1 ; 69.51,29.28 69.51,29.27
DS1302_RST: length 49.6
  Top Layer w0.381: U7.1 37.32,27.2 37.71,27.58 62.73,27.58 63.11,27.2 63.11,25.43 63.75,24.79 71.25,24.79 72.04,25.58 72.04,30.16 71.66,30.54 U3.5 67.69,30.54 67.19,31.04 67.19,32.91 R17.1
I2C_SCL: length 26.4
  Top Layer w0.355: 30.93,15.06 30.93,12.31 30.49,11.88 28.09,11.88 27.8,11.59 27.8,10.2 26.03,8.43 16.93,8.43 ; 16.93,8.43 R13.1 ; 16.93,8.43 16.93,10.56 17.24,10.87 19.25,10.87 U2.6
I2C_SDA: length 21.9
  Top Layer w0.355: R16.1 19.55,5.8 v1(19.55,7.42) ; U7.24 30.12,12.99 29.78,12.65 27.84,12.65 27.29,12.1 27.29,12.09 27.09,11.89 27.09,10.51 26.2,9.63 v1(22.73,9.63) U2.5
  Bottom Layer w0.355: v1(22.73,9.63) 20.05,9.63 19.56,9.14 19.56,7.43 v1(19.55,7.42)
I2C_WP: length 19.1
  Top Layer w0.355: U2.7 19.3,12.2 v1(23.85,12.2) 26.32,12.2 27.53,13.41 28.91,13.41 29.32,13.83 U7.23 ; v1(22.25,7.18) 22.25,5.82 R2.1
  Bottom Layer w0.355: v1(22.25,7.18) 22.25,7.18 22.25,7.55 23.85,9.15 v1(23.85,12.2)
P30: length 22.2
  Top Layer w0.355: U7.18 20.76,20.05 20.25,20.56 20.25,35.27 D1.2
P31: length 25.3
  Top Layer w0.355: R1.2 17.93,36.42 17.93,35 19.41,33.52 19.41,20.31 20.47,19.25 U7.19
SEGA: length 78.4
  Top Layer w0.355: R11.1 58.85,43.74 59.16,44.04 73,44.04 75.84,46.89 75.84,58.34 75.24,58.95 62.54,58.95 ; 62.54,58.95 SEG2.11 ; 62.54,58.95 31.93,58.95 31.55,58.57 31.55,57.27 SEG1.11
SEGB: length 67.4
  Top Layer w0.355: R4.2 55.95,43.91 56.92,44.88 72.64,44.88 75.03,47.27 75.03,56.77 74.54,57.26 SEG2.7
  Bottom Layer w0.355: SEG1.7 41.76,57.32 41.76,58.45 42.22,58.9 72.31,58.9 72.7,58.52 SEG2.7
SEGC: length 63.1
  Top Layer w0.355: SEG2.4 67.62,46.23 67.03,45.64 53.59,45.64 53.04,45.09 R5.2
  Bottom Layer w0.355: SEG1.4 36.62,45.37 37.49,44.5 70.81,44.5 71.45,45.14 71.45,47.95 71.09,48.31 67.98,48.31 67.62,47.95 SEG2.4
SEGD: length 86.8
  Top Layer w0.355: SEG2.2 62.53,47 62.53,48.26 62.23,48.56 50.65,48.56 50.13,48.05 R6.2
  Bottom Layer w0.355: SEG2.2 62.54,49.22 62.51,49.25 63.04,49.78 74.27,49.78 75.06,49 75.06,44.48 73.35,42.77 32.77,42.77 31.54,44 SEG1.2
SEGDP: length 65.9
  Top Layer w0.355: R10.2 38.51,44.55 37.9,45.16 34.54,45.16 34.09,45.62 34.09,46.99 SEG1.3
  Bottom Layer w0.355: SEG1.3 34.08,44.33 34.67,43.74 72.97,43.74 74.17,44.93 74.17,48.23 73.38,49.02 65.71,49.02 65.02,48.34 65.02,47.06 SEG2.3
SEGE: length 92.6
  Top Layer w0.355: v1(48.95,46.99) 47.65,46.99 47.23,46.57 R7.2 ; v1(51.18,47.02) 51.2,47 SEG2.1
  Bottom Layer w0.355: SEG2.1 60,47.88 62.71,50.6 74.93,50.6 75.92,49.61 75.92,44.2 73.76,42.04 30.05,42.04 29,43.08 SEG1.1 ; v1(51.18,47.02) 48.97,47.02 v1(48.95,46.99)
SEGF: length 46.4
  Top Layer w0.355: 44.32,55.83 64.64,55.83 65.07,56.26 65.07,57.25 SEG2.10 ; 44.32,55.83 34.44,55.83 34.06,56.21 34.06,57.24 SEG1.10 ; 44.32,55.83 R8.2
SEGG: length 39.9
  Top Layer w0.355: R9.2 41.41,45.2 41,45.62 39.42,45.62 39.19,45.85 39.19,46.97 SEG1.5
  Bottom Layer w0.355: SEG1.5 39.16,45.72 39.52,45.36 69.82,45.36 70.18,45.72 70.18,46.98 SEG2.5
SIG_IN: length 3.2
  Top Layer w0.381: H1.1 87.2,38.68 R91.2
V_CS: length 29.8
  Top Layer w0.355: R96.1 31.09,2.44 v1(33.6,2.44) ; U12.4 43.35,2.7 v1(40.33,2.7) 35.63,2.7 34.93,3.4 U7.30
  Bottom Layer w0.355: v1(33.6,2.44) 33.86,2.7 v1(40.33,2.7)
V_MISO: length 24.4
  Top Layer w0.355: v1(32.72,7.63) 32.71,7.64 R94.1 ; U7.32 36.53,7.45 37.19,6.79 v1(40.31,6.79) 43.33,6.79 U12.2
  Bottom Layer w0.355: v1(32.72,7.63) 32.76,7.66 33.67,7.66 34.55,6.79 v1(40.31,6.79)
V_MOSI: length 22.8
  Top Layer w0.355: U7.33 37.32,9.07 37.7,8.7 v1(40.3,8.7) 43.34,8.7 U12.1 ; R93.1 31.09,10.25 v1(32.79,10.25)
  Bottom Layer w0.355: v1(32.79,10.25) 32.79,10.25 40,10.25 40.3,9.96 v1(40.3,8.7)
V_SCLK: length 26.7
  Top Layer w0.355: U7.31 35.72,5.91 36.92,4.72 v1(40.3,4.72) 43.37,4.72 U12.3 ; R95.1 31.09,5.06 v1(33.38,5.06)
  Bottom Layer w0.355: v1(33.38,5.06) 33.72,4.72 v1(40.3,4.72)
$1N1823: length 2.6
  Top Layer w0.355: X1.2 77.46,28 U3.2
$1N1825: length 2.6
  Top Layer w0.355: 75.51,29.27 77.66,29.27 X1.1
$1N1898:
  vias: v1(65.04,26.77) v1(66.32,26.78) v1(67.61,26.79) v1(68.25,17.14) v1(68.25,15.47) v1(68.25,13.63) v1(68.26,11.7) v1(69.82,17.14) v1(69.79,11.71) v1(71.31,17.14) v1(71.26,11.71) v1(72.66,17.14)
$1N1910: length 6.7
  Top Layer w0.355: R1.1 17.93,39.35 18.69,40.11 18.69,42.16 18.22,42.62 16.2,42.62
$1N1912: length 6.5
  Top Layer w0.355: D1.1 20.23,40.95 v1(19.83,41.35) ; 16.2,41.35 16.21,41.36 v1(17.8,41.36)
  Bottom Layer w0.355: v1(17.8,41.36) 17.8,41.35 v1(19.83,41.35)
$1N1918: length 11.4
  Top Layer w0.355: C7.2 22.82,39.49 22.46,39.86 21.43,39.86 21.09,40.19 21.09,43.54 20.74,43.89 16.2,43.89
$1N1920: length 22.2
  Top Layer w0.355: R15.2 11.19,52.68 11.07,52.81 10.21,52.81 9.41,53.61 9.41,55.73 9.15,55.98 9.15,57.25 9.41,57.51 9.41,58.15 9.16,58.4 6.88,58.4 6.53,58.05 6.53,55.21 6.78,54.96 6.78,53.69 6.53,53.44 6.53,52.29 6.91,51.91 6.91,50.76 6.53,50.39 6.53,49.36 7.27,48.61 CN1.2
$1N1922: length 22.2
  Top Layer w0.355: R18.2 11.19,53.44 11.07,53.31 10.42,53.31 9.91,53.82 9.91,58.36 9.37,58.91 6.67,58.91 6.02,58.26 6.02,49.36 5.27,48.61 CN1.3
$1N1964: length 18.3
  Top Layer w0.381: 14.57,27.7 14.58,27.69 ; 14.57,27.7 15.96,27.7 v1(15.96,27.69) ; 14.57,27.7 R21.2 ; v1(2.78,27.72) 1.52,27.72 1.45,27.79
  Bottom Layer w0.381: v1(2.78,27.72) 2.8,27.69 v1(15.96,27.69)
$1N1967: length 5.1
  Top Layer w0.508: U6.6 79.82,40.54 80.12,40.84 80.12,41.6 79.92,41.8 78.07,41.8 U6.7
$1N1974: length 5.8
  Top Layer w0.508: R91.1 82.94,38.6 81.51,38.6 79.64,36.73 U6.3
$1N1985: length 14.3
  Top Layer w0.508: U6.5 78.03,39.24 76.57,39.24 75.97,38.64 75.97,34.48 76.26,34.19 U6.1 80.08,34.19 81.64,32.62 83.02,32.62 R92.1
$1N1990: length 9.7
  Top Layer w0.508: R92.2 85.04,32.63 85.04,33.88 84.84,34.08 83.47,34.08 83.02,34.52 R90.1 82.83,35.46 U6.2
$1N1998: length 4.3
  Top Layer w0.355: R98.1 53.5,4.29 51.9,4.29 51.46,4.74 U12.6
$1N2000: length 4.3
  Top Layer w0.355: R97.1 53.53,7.13 51.91,7.13 51.51,6.74 U12.7
$1N2030: length 9.5
  Top Layer w0.355: SP1.1 62.33,7.49 61.98,7.14 R97.2
$1N2034: length 8.5
  Top Layer w0.355: SP1.2 62.33,3.95 61.98,4.3 R98.2
$1N2066: length 2.3
  Top Layer w0.762: R19.1 LED1.1
$1N4705: length 17.1
  Top Layer w0.381: R11.2 58.86,40.82 58.86,36.02 57.91,35.08 51.49,35.08 50.65,34.23 U4.15
$1N4961: length 7.6
  Top Layer w0.355: R4.1 55.98,40.79 55.98,38.61 55.5,38.13 52.25,38.13 51.92,37.8 U4.1
$1N4962: length 5.9
  Top Layer w0.355: U4.2 50.65,38.43 51.05,38.84 52.55,38.84 53.04,39.32 R5.1
$1N4964: length 4.3
  Top Layer w0.355: R6.1 50.13,39.24 49.38,38.48 U4.3
$1N4966: length 4.4
  Top Layer w0.355: U4.4 48.11,38.53 47.23,39.41 R7.1
$1N4968: length 5.7
  Top Layer w0.355: U4.5 46.84,38.8 45.83,39.8 44.68,39.8 44.32,40.16 44.32,40.82 R8.1
$1N4970: length 7.7
  Top Layer w0.355: U4.6 45.57,38.66 45.14,39.09 41.76,39.09 41.4,39.45 41.4,40.81 R9.1
$1N4972: length 9.3
  Top Layer w0.355: U4.7 44.3,38 43.92,38.38 38.89,38.38 38.51,38.76 R10.1
$1N5017: length 12.2
  Top Layer w0.381: U4.9 43.02,30.88 v1(41.41,30.88) ; 34.24,30.79 v1(34.24,29.05)
  Bottom Layer w0.381: v1(41.41,30.88) 41.41,29.41 41.05,29.05 v1(34.24,29.05)
$1N6015: length 13.8
  Top Layer w0.355: 16.2,45.16 16.2,45.45 16.08,45.57 14.44,45.57 13.24,46.77 13.24,48.98 15.88,51.62 15.88,52.48 15.59,52.77 14.14,52.77 R15.1
$1N6017: length 13.7
  Top Layer w0.355: 16.2,46.43 16.2,46.21 16.08,46.08 14.65,46.08 13.75,46.98 13.75,48.77 16.39,51.41 16.39,52.69 15.8,53.28 14.14,53.28 R18.1

## Copper pours and planes (outline as drawn; the poured copper is in the pictures)
+5V on Top Layer: 13.89,24.43 7.1,24.43 6.83,24.71 6.83,26.25 6.93,26.36 14.4,26.36 14.54,26.22 14.54,24.73 14.24,24.43 13.9,24.43
GND on Top Layer: -2.21,61.77 91.23,61.77 91.23,-1.84 -2.21,-1.84
GND on Bottom Layer: -4.66,64.49 92.59,64.49 92.59,-3.88 -4.66,-3.88
VUSB on Top Layer: 8.43,44.46 8.43,45.9 8.21,46.11 6.51,46.11 6.34,45.94 6.34,38.94 6.62,38.67 8.2,38.67 8.45,38.42 8.45,31.96 8.76,31.65 11.46,31.65 11.8,31.31 11.8,27.07 11.99,26.88 13.14,26.88 13.32,27.06 13.32,40.22 12.99,40.55 8.64,40.55 8.41,40.77 8.41,44.45
VUSB on Top Layer: 12.59,26.88 6.52,26.88 6.08,26.44 4.8,26.44 4.58,26.66 4.58,28.9 4.8,29.12 6.29,29.12 6.47,28.95 12.29,28.95 12.59,28.65
$1N1898 on Top Layer: 64.68,26.28 64.41,26.55 64.41,27.05 64.67,27.31 70.38,27.31 70.57,27.12 70.57,26.55 70.31,26.28
$1N1898 on Top Layer: 71.88,11.01 67.95,11.01 67.25,11.71 67.25,17.43 67.78,17.95 73.73,17.95 74.14,17.54 74.14,11.45 73.7,11 71.89,11
$1N1898 on Bottom Layer: 69.92,11.01 67.98,11.01 67.27,11.71 67.27,17.45 67.78,17.95 73.73,17.95 74.14,17.54 74.14,11.45 73.7,11 69.92,11
$1N1898 on Bottom Layer: 70.84,10.91 67.54,10.91 66.64,11.81 66.64,23.76 63.85,26.55 63.85,27.99 64.86,28.99 70,28.99 70.76,28.23 70.76,11.6 70.72,11.55 70.72,11.03

Small or netless copper shapes (teardrops, artwork), in the pictures only: 281 on Top Layer, 73 on Bottom Layer
